# EAGLE design boardPCBlayout2 (EAGLE 9.4.2)
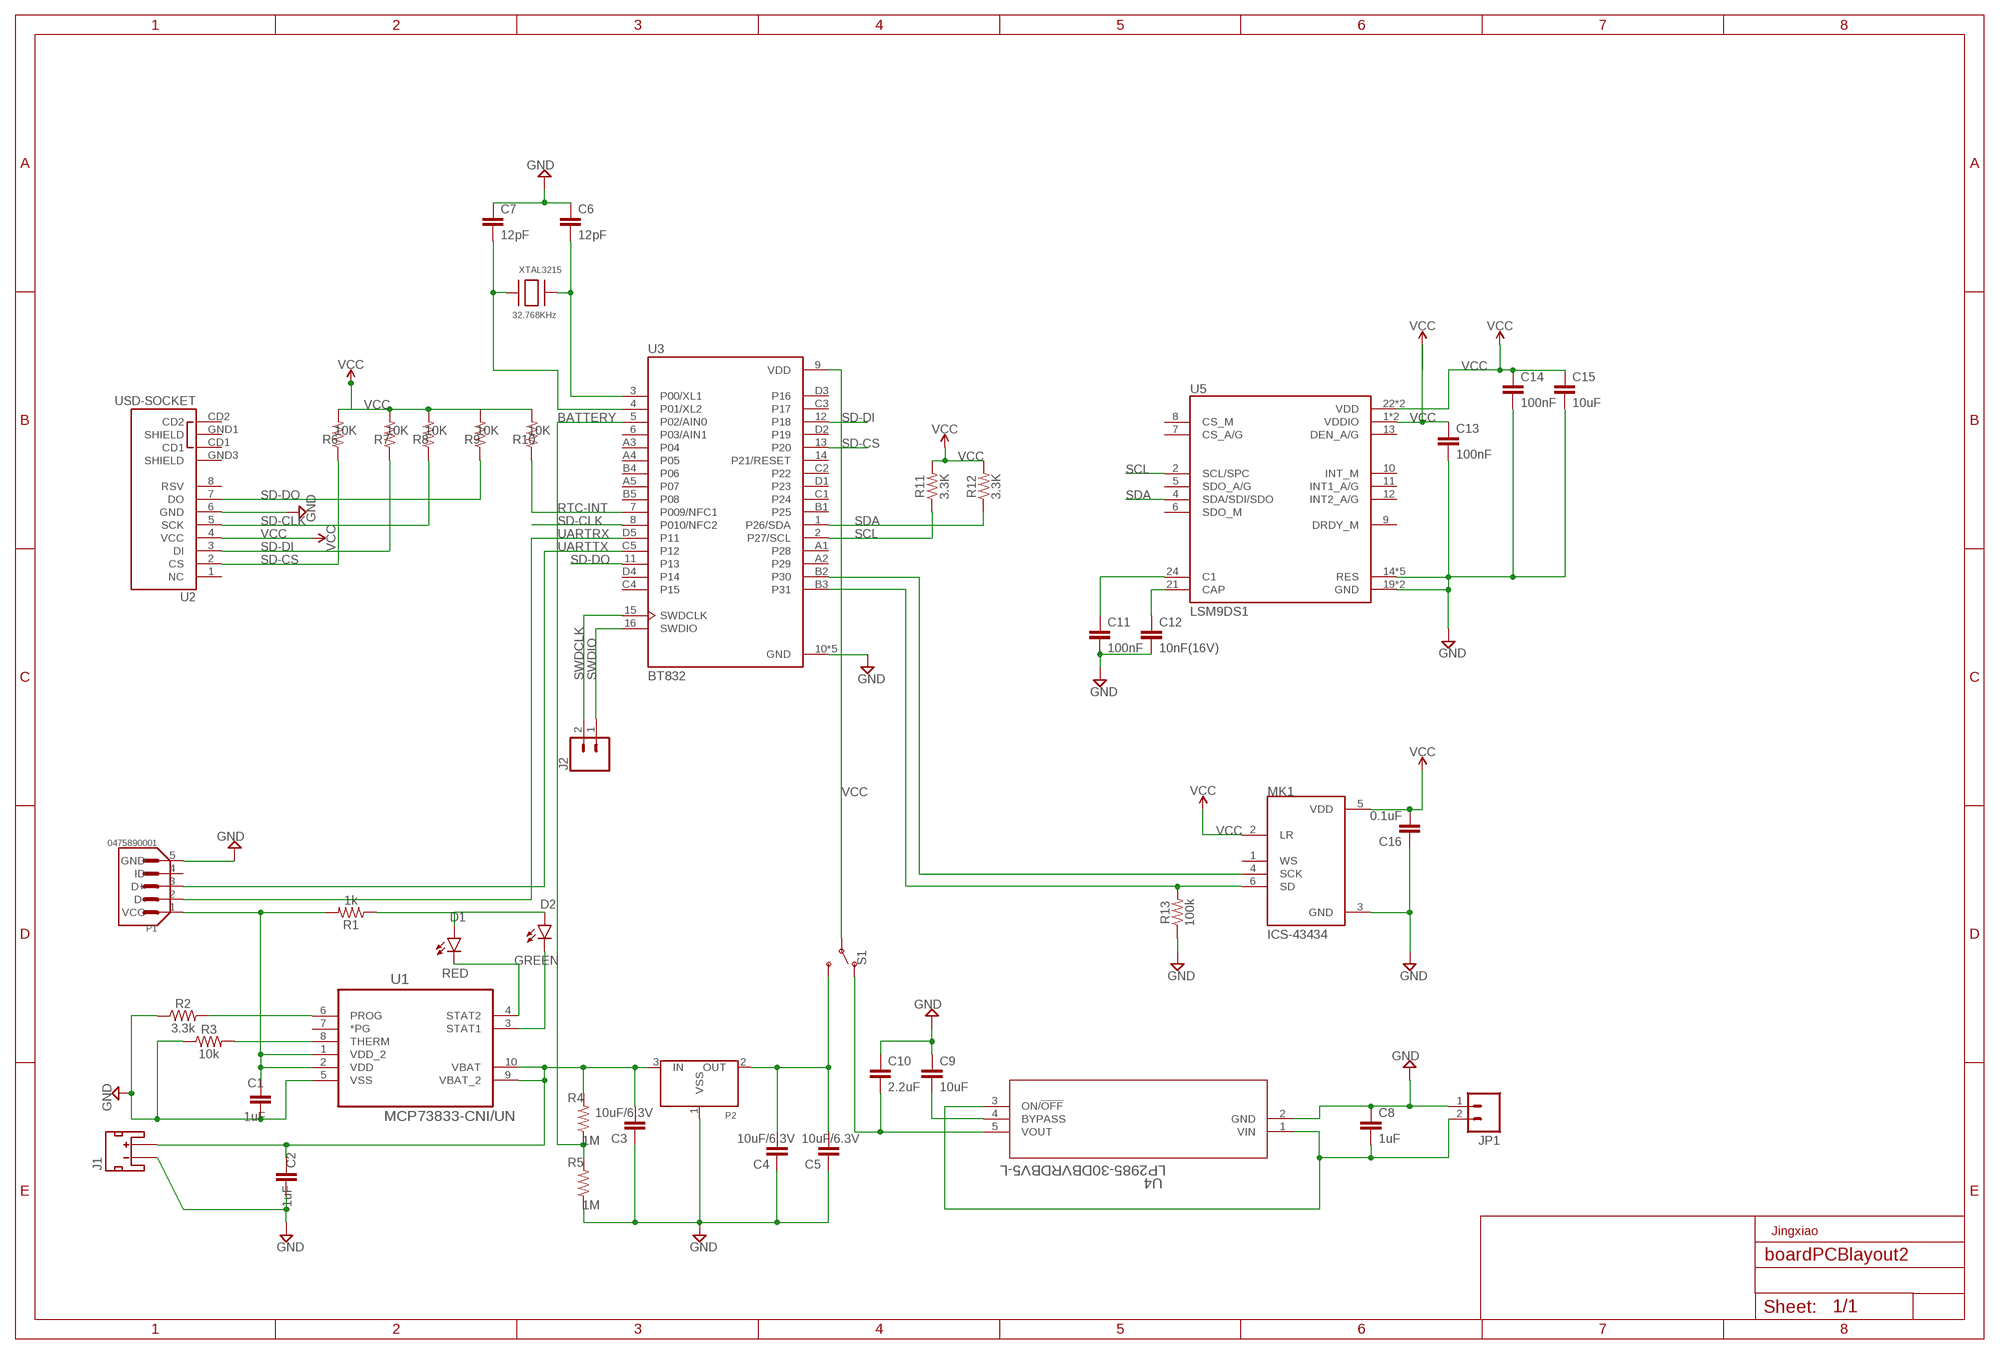
[diagram p0: schematic, sheet 1]

## Parts
C1  1uF  CC0603CRNPO9BN1R0  [CAP_0603]
C2  1uF  CC0603CRNPO9BN1R0  [CAP_0603]
C3  10uF/6.3V  0.18UF-0603-10V-10%  [0603]
C4  10uF/6.3V  0.18UF-0603-10V-10%  [0603]
C5  10uF/6.3V  0.18UF-0603-10V-10%  [0603]
C6  12pF  0.18UF-0603-10V-10%  [0603]
C7  12pF  0.18UF-0603-10V-10%  [0603]
C8  1uF  0.18UF-0603-10V-10%  [0603]
C9  10uF  0.18UF-0603-10V-10%  [0603]
C10  2.2uF  0.18UF-0603-10V-10%  [0603]
C11  100nF  0.18UF-0603-10V-10%  [0603]
C12  10nF(16V)  0.18UF-0603-10V-10%  [0603]
C13  100nF  0.18UF-0603-10V-10%  [0603]
C14  100nF  0.18UF-0603-10V-10%  [0603]
C15  10uF  0.18UF-0603-10V-10%  [0603]
C16  0.1uF  0.18UF-0603-10V-10%  [0603]
D1  RED  LTST-C190TBKT  [LED-0603]
D2  GREEN  LTST-C190TBKT  [LED-0603]
J1  JST_2MM_MALE  [JST-2-SMD]
J2  CONN_02  [1X02]
JP1  M023.5MM-NO_SILK  [SCREWTERMINAL-3.5MM-2-NS]
MK1  ICS-43434  [MIC_ICS-43434]
P1  0475890001  [MOLEX_0475890001]
P2  XC6206SOT-23  [XC6206_SOT-23]
R1  1k  1.6KOHM-0603-1/10W-1%  [0603]
R2  3.3k  14KOHM-0603-1/10W-1%  [0603]
R3  10k  14KOHM-0603-1/10W-1%  [0603]
R4  1M  0.05OHM-0603-1/5W-1%  [0603]
R5  1M  0.05OHM-0603-1/5W-1%  [0603]
R6  10K  0.05OHM-0603-1/5W-1%  [0603]
R7  10K  0.05OHM-0603-1/5W-1%  [0603]
R8  10K  0.05OHM-0603-1/5W-1%  [0603]
R9  10K  0.05OHM-0603-1/5W-1%  [0603]
R10  10K  0.05OHM-0603-1/5W-1%  [0603]
R11  3.3K  0.05OHM-0603-1/5W-1%  [0603]
R12  3.3K  0.05OHM-0603-1/5W-1%  [0603]
R13  100k  0.05OHM-0603-1/5W-1%  [0603]
S1  SWITCH-SPDT-PTH-11.6X4.0MM  [SWITCH_SPDT_PTH_11.6X4.0MM]
U1  MCP73833-CNI/UN  [SOP50P490X110-10N]
U2  USD-SOCKET  [MICROSD_1:1]
U3  BT832  [BLEMODULE_BT832]
U4  LP2985-30DBVRDBV5-L  [DBV5-L]
U5  LSM9DS1  [PQFN24P43_350X300X102L35X23N]
XTAL3215  32.768KHz  XTAL-3.2X1.5  [XTAL3215]

## Nets
BATTERY: R4.1 R5.2 U3.5(P02/AIN0)
GND: C1.2 C3.1 C4.1 C5.1 C6.1 C7.1 C8.1 C9.1 C10.1 C11.2 C12.2 C13.2 C14.2 C15.2 C16.1 JP1.1 MK1.3(GND) P1.5(GND) P2.1(VSS) R2.1 R3.1 R5.1 R13.1 U1.5(VSS) U2.6(GND) U3.10(GND) U3.A0(GND) U3.B0(GND) U3.C0(GND) U3.D0(GND) U4.2(GND) U5.14(RES) U5.15(RES) U5.16(RES) U5.17(RES) U5.18(RES) U5.19(GND) U5.20(GND)
N$1: C1.1 P1.1(VCC) R1.2 U1.1(VDD_2) U1.2(VDD)
N$2: D1.C U1.4(STAT2)
N$3: D1.A D2.A R1.1
N$4: D2.C U1.3(STAT1)
N$5: C2.2 J1.1(-) ; supply symbol labelled GND
N$6: C2.1 C3.2 J1.2(+) P2.3(IN) R4.2 U1.9(VBAT_2) U1.10(VBAT)
N$8: R2.2 U1.6(PROG)
N$9: R3.2 U1.8(THERM)
N$10: MK1.6(SD) R13.2 U3.B3(P31)
N$11: C7.2 U3.4(P01/XL2) XTAL3215.P$1
N$12: C6.2 U3.3(P00/XL1) XTAL3215.P$2
N$13: C10.2 S1.1(O) U4.5(VOUT)
N$14: C12.1 U5.21(CAP)
N$15: C8.2 JP1.2 U4.1(VIN) U4.3(ON/!OFF)
N$16: C9.2 U4.4(BYPASS)
N$18: C11.1 U5.24(C1)
N$19: C4.2 C5.2 P2.2(OUT) S1.3(S)
N$20: MK1.4(SCK) U3.B2(P30)
RTC-INT: R10.1 U3.7(P009/NFC1)
SCL: R11.1 U3.2(P27/SCL) U5.2(SCL/SPC)
SD-CLK: R8.1 U2.5(SCK) U3.8(P010/NFC2)
SD-CS: R6.1 U2.2(CS) U3.13(P20)
SD-DI: R7.1 U2.3(DI) U3.12(P18)
SD-DO: R9.1 U2.7(DO) U3.11(P13)
SDA: R12.1 U3.1(P26/SDA) U5.4(SDA/SDI/SDO)
SWDCLK: J2.2 U3.15(SWDCLK)
SWDIO: J2.1 U3.16(SWDIO)
UARTRX: P1.2(D-) U3.D5(P11)
UARTTX: P1.3(D+) U3.C5(P12)
VCC: C13.1 C14.1 C15.1 C16.2 MK1.2(LR) MK1.5(VDD) R6.2 R7.2 R8.2 R9.2 R10.2 R11.2 R12.2 S1.2(P) U2.4(VCC) U3.9(VDD) U5.1(VDDIO) U5.3(VDDIO) U5.22(VDD) U5.23(VDD)
Unconnected: J1.NC1(PAD1) J1.NC2(PAD2) MK1.1(WS) P1.4(ID) U1.7(*PG) U2.1(NC) U2.8(RSV) U2.CD1 U2.CD2 U2.GND1(SHIELD) U2.GND3(SHIELD) U3.6(P03/AIN1) U3.14(P21/RESET) U3.A1(P28) U3.A2(P29) U3.A3(P04) U3.A4(P05) U3.A5(P07) U3.B1(P25) U3.B4(P06) U3.B5(P08) U3.C1(P24) U3.C2(P22) U3.C3(P17) U3.C4(P15) U3.D1(P23) U3.D2(P19) U3.D3(P16) U3.D4(P14) U5.5(SDO_A/G) U5.6(SDO_M) U5.7(CS_A/G) U5.8(CS_M) U5.9(DRDY_M) U5.10(INT_M) U5.11(INT1_A/G) U5.12(INT2_A/G) U5.13(DEN_A/G)

## Notes on the sheet
- Jingxiao

## Library data of the parts
C1 C2 = Resistor_Capacitor:CC0603CRNPO9BN1R0: CAP CER 1PF 50V C0G/NPO 0603 Manufacturer's datasheet <http://www.yageo.com/documents/recent/UPY-GP_NP0_16V-to-50V_16.pdf>; CREATED_BY: PCBLayout.com; DIGIKEY_PART_NUMBER: 311-1049-2-ND; MANUFACTURER: Yageo; MPN: CC0603CRNPO9BN1R0; PACKAGE: SMD 0603
C3-C16 = SparkFun-Capacitors:0.18UF: 0.18µF ceramic capacitor A capacitor is a passive two-terminal electrical component used to store electrical energy temporarily in an electric field.; PROD_ID: CAP-12380; VALUE: 0.18uF
D1 D2 = LED:LTST-C190TBKT: LED BLUE CLEAR CHIP SMD Manufacturer's datasheet <http://optoelectronics.liteon.com/upload/download/DS-22-99-0224/LTST-C190TBKT.PDF>; CREATED_BY: PCBLayout.com; DIGIKEY_PART_NUMBER: 160-1646-1-ND; MANUFACTURER: Lite-On Inc.; MPN: LTST-C190TBKT; PACKAGE: 0603
J1 = SparkFun-Connectors:JST_2MM_MALE: JST 2MM MALE RA CONNECTOR Two pin, compact surface mount connector. Commonly used as a battery input connection point. We really like the solid locking feeling and high current rating on these small connectors. We use these all the time as battery connectors. Mates to single-cell LiPo batteries. Here is the connector we sell at SparkFun: JST Right Angle Connector - White <https://www.sparkfun.com/products/8612> (PRT-08612) Datasheet <http://www.sparkfun.com/datasheets/Prototyping/Connectors/JST-Horizontal.pdf> It was used on these SparkFun products: SparkFun MOSFET Power Controller <https://www.sparkfun.com/products/11214> (PRT-11214) SparkFun Battery Babysitter - LiPo Battery Manager <https://www.sparkfun.com/products/13777> (PRT-13777) And many, many others that required a lipo battery connection.; PROD_ID: CONN-11443; SF_ID: PRT-08612
J2 = SparkFun-Connectors:CONN_02: Multi connection point. Often used as Generic Header-pin footprint for 0.1 inch spaced/style header connections On any of the 0.1 inch spaced packages, you can populate with these: Break Away Headers - Straight <https://www.sparkfun.com/products/116> (PRT-00116) Break Away Male Headers - Right Angle <https://www.sparkfun.com/products/553> (PRT-00553) Female Headers <https://www.sparkfun.com/products/115> (PRT-00115) Break Away Headers - Machine Pin <https://www.sparkfun.com/products/117> (PRT-00117) Break Away Female Headers - Swiss Machine Pin <https://www.sparkfun.com/products/743> (PRT-00743) For SCREWTERMINALS and SPRING TERMINALS visit here: Screw Terimnals on SparkFun.com <https://www.sparkfun.com/search/results?term=Screw+Terminals> (5mm/3.5mm/2.54mm spacing) This device is also useful as a general connection point to wire up your design to another part of your project. Our various solder wires solder well into these plated through hole pads. Hook-Up Wire - Assortment (Stranded, 22 AWG) <https://www.sparkfun.com/products/11375> (PRT-11375) Hook-Up Wire - Assortment (Solid Core, 22 AWG) <https://www.sparkfun.com/products/11367> (PRT-11367) View the entire wire category on our website here <https://www.sparkfun.com/categories/141> Special notes: Molex polarized connector foot print use with: PRT-08233 with associated crimp pins and housings. 2.54_SCREWTERM for use with PRT-10571. 3.5mm Screw Terminal footprints for PRT-08084 5mm Screw Terminal footprints for use with PRT-08432
JP1 = screw hold connector:M02: Standard 2-pin 0.1" header. Use with - straight break away headers ( PRT-00116) - right angle break away headers (PRT-00553) - swiss pins (PRT-00743) - machine pins (PRT-00117) - female headers (PRT-00115) Molex polarized connector foot print use with: PRT-08233 with associated crimp pins and housings. 2.54_SCREWTERM for use with PRT-10571. 3.5mm Screw Terminal footprints for PRT-08084 5mm Screw Terminal footprints for use with PRT-08432; PROD_ID: CONN-08399
MK1 = ICS-43434:ICS-43434: Multi-Mode Microphone with I2S Digital Output; AVAILABILITY: Unavailable; DESCRIPTION: Multi-Mode Microphone with I2S Digital Output; MF: TDK InvenSense; MP: ICS-43434; PACKAGE: LGA-6 TDK-InvenSense; PRICE: None
P1 = USB battery charger:0475890001: Conn Micro USB Type AB RCP 5 POS 0.65mm Solder RA SMD 5 Terminal 1 Port T/R; DESCRIPTION: Conn Micro USB Type AB RCP 5 POS 0.65mm Solder RA SMD 5 Terminal 1 Port T/R; DIGI-KEY_PART_NUMBER: WM17143CT-ND; DIGI-KEY_PURCHASE_URL: https://www.digikey.com/product-detail/en/molex/0475890001/WM17143CT-ND/1832255?utm_source=snapeda&utm_medium=aggregator&utm_campaign=symbol; MF: Molex; MP: 0475890001; PACKAGE: None
P2 = Voltage Regulator:XC6206: XC6206P , linear regulator. Producted by TOREX.Co Store Information: EXCEL device corporation http://www.excel-d.com/access/index.html
R1 = SparkFun-Resistors:1.6KOHM: 1.6kΩ resistor A resistor is a passive two-terminal electrical component that implements electrical resistance as a circuit element. Resistors act to reduce current flow, and, at the same time, act to lower voltage levels within circuits. - Wikipedia; PROD_ID: RES-08361; VALUE: 1.6k
R2 R3 = SparkFun-Resistors:14KOHM: 14kΩ resistor A resistor is a passive two-terminal electrical component that implements electrical resistance as a circuit element. Resistors act to reduce current flow, and, at the same time, act to lower voltage levels within circuits. - Wikipedia; PROD_ID: RES-13340; VALUE: 14k
R4-R13 = SparkFun-Resistors:0.05OHM: 0.05Ω resistor A resistor is a passive two-terminal electrical component that implements electrical resistance as a circuit element. Resistors act to reduce current flow, and, at the same time, act to lower voltage levels within circuits. - Wikipedia; PROD_ID: RES-12535; VALUE: 0.05
S1 = 2positon jumper:SWITCH-SPDT: Single Pole, Double Throw (SPDT) Switch Single-pole, double-throw (SPDT) switch. Variant Overview SMD-AYZ0202 Surface Mount DPDT Switch <https://www.sparkfun.com/products/597> (COM-00597) Used on e.g. LilyPad Arduino USB - ATmega32U4 Board <https://www.sparkfun.com/products/12049> PTH-11.6X4.0MM SPDT Mini Power Switch <https://www.sparkfun.com/products/102> (COM-00102) Used on e.g. SparkFun Simon Says - Through-Hole Soldering Kit <https://www.sparkfun.com/products/10547> (KIT-10547) PTH-11.6X4.0MM-KIT KIT version of SPDT Mini Power Switch - Simplifies soldering by removing tStop of switch pins - only one side can be soldered. PTH-11.6X4.0MM-LOCK LOCK version of SPDT Mini Power Switch - Offset pins hold switch in place for easier soldering. SMD-RIGHT-ANGLE Surface Mount Right Angle Switch <https://www.sparkfun.com/products/10860> (COM-10860) Used on e.g. SparkFun ESP8266 Thing <https://www.sparkfun.com/products/13231>; PROD_ID: SWCH-08261; SF_SKU: COM-00102
U1 = MCP73833-CNI_UN:MCP73833-CNI/UN: LI-ION/LI-POLY CONTROLLERS; DESCRIPTION: Linear Charge Management Controller Li-Ion/Li-Pol 1mA 4.2V/4.35V/4.4V/4.5V 10-Pin MSOP Tube; DIGI-KEY_PART_NUMBER: MCP73833-CNI/UN-ND; DIGI-KEY_PURCHASE_URL: https://www.digikey.com/product-detail/en/microchip-technology/MCP73833-CNI-UN/MCP73833-CNI-UN-ND/1223169?utm_source=snapeda&utm_medium=aggregator&utm_campaign=symbol; MF: Microchip; MP: MCP73833-CNI/UN; PACKAGE: MSOP-10 Microchip
U2 = micro SD card holder:USD-SOCKET: microSD Socket Push-push type uSD socket. Schematic element and footprint production proven. Spark Fun Electronics SKU : PRT-00127. tDoc lines correctly indicate media card edge positions when inserting (unlocked, locked, depressed). NOTE: CD1 and CD2 are connected internally; PROD_ID: CONN-07820
U3 = BT832:BT832: BLE 5 Module: Nordic nRF52832 SoC, Cortex M4F with PCB trace antenna; AVAILABILITY: Unavailable; DESCRIPTION: BLE 5 Module: Nordic nRF52832 SoC, Cortex M4F with PCB trace antenna; MF: Fanstel Corp.; MP: BT832; PACKAGE: SMD-16 Fanstel; PRICE: None
U4 = LP2985:LP2985-30DBVR; MANUFACTURER_PART_NUMBER: LP298530DBVR; VENDOR: Texas Instruments
U5 = LSM9DS1:LSM9DS1: iNEMO inertial module: 3D accelerometer, 3D gyroscope, 3D magnetometer; AVAILABILITY: Unavailable; DESCRIPTION: iNEMO inertial module: 3D accelerometer, 3D gyroscope, 3D magnetometer; MF: STMicroelectronics; MP: LSM9DS1; PACKAGE: TFLGA-24 STMicroelectronics; PRICE: None
XTAL3215 = XTAL3215:XTAL: Low cost SMT crystals, no capacitors included http://www.ladyada.net/library/eagle

## Board
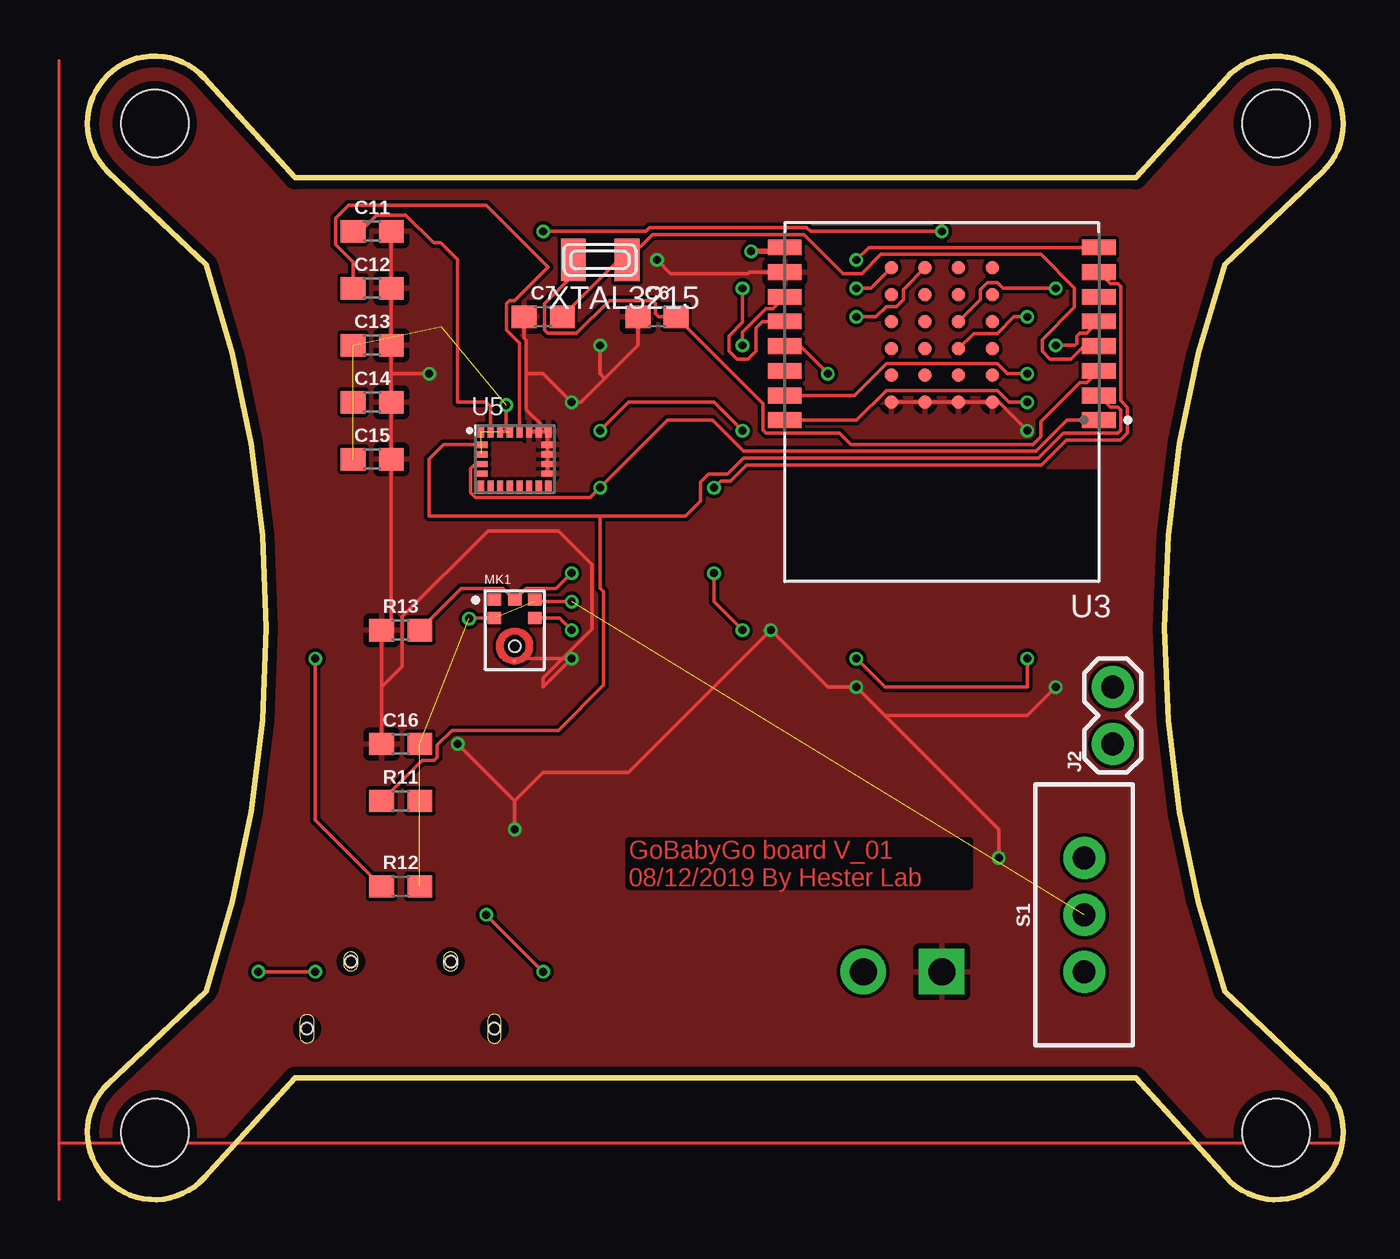
[diagram p1: board, top side]
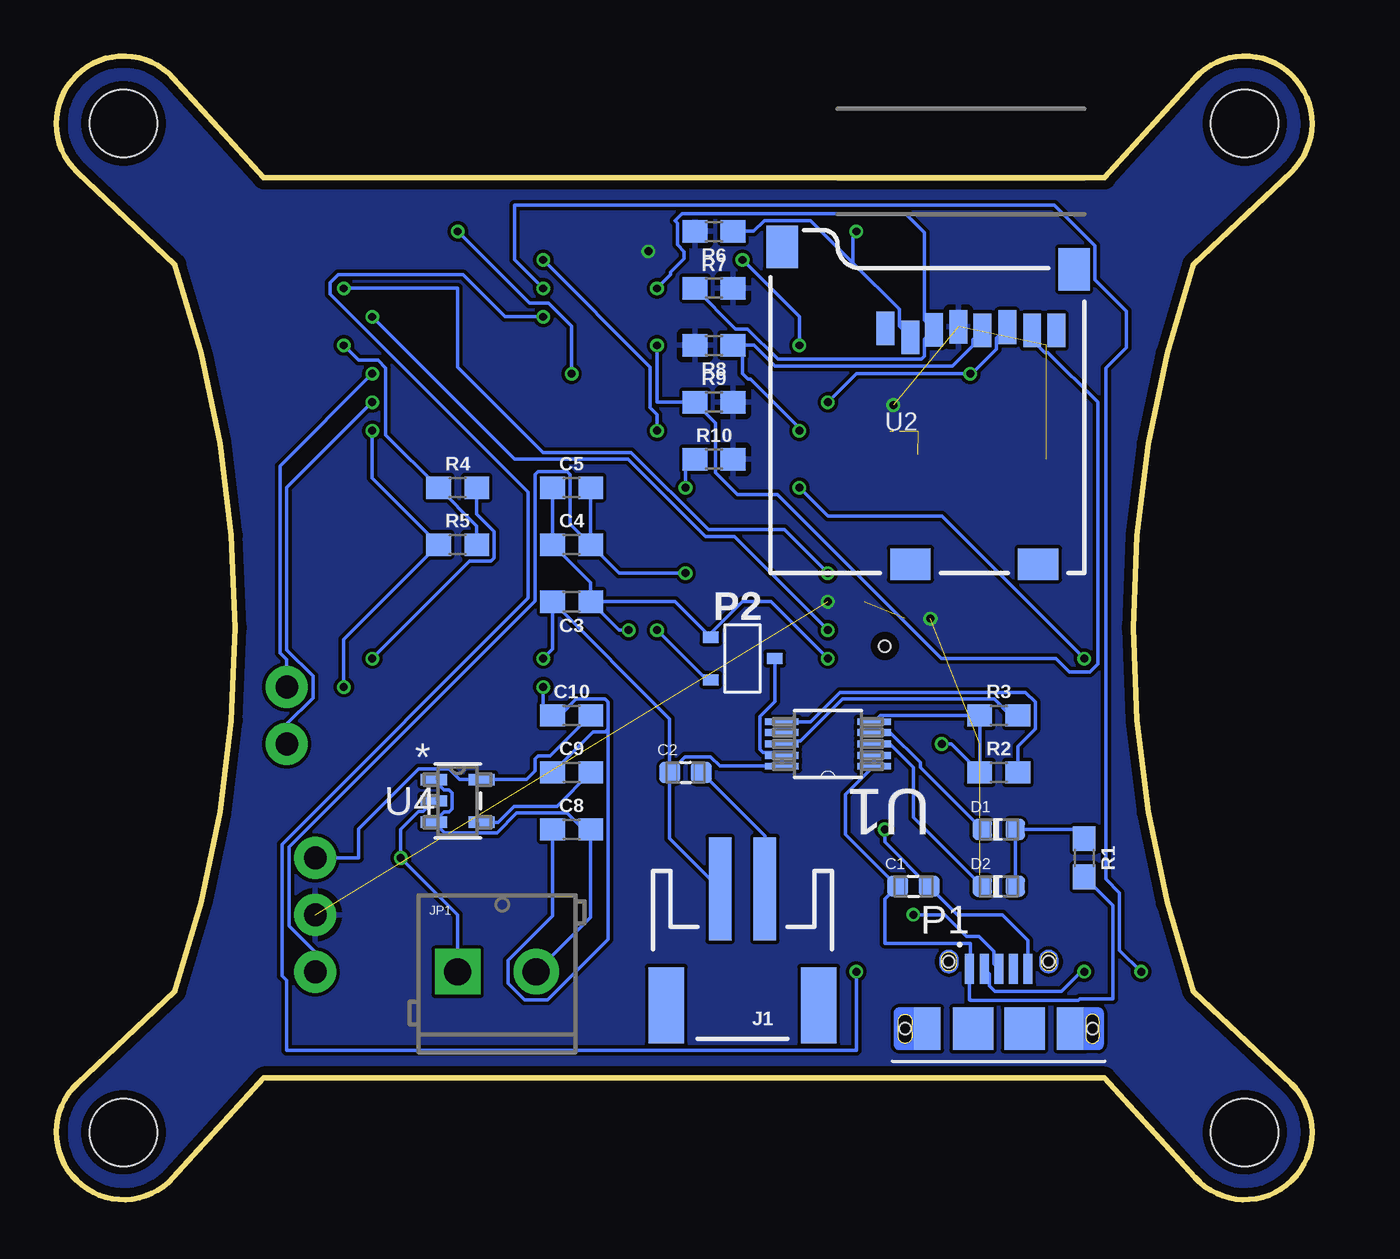
[diagram p2: board, bottom side, seen from below]

Size 56 x 51 mm. Coordinates in mm from the lower left corner, seen from the top.
Outline: 55.07,45.83 arc184 50.78,50.01 46.75,45.57 9.25,45.57 5.22,50.01 arc184 0.93,45.83 5.29,41.7 arc-38 5.29,9.29 0.93,5.17 arc184 5.22,0.98 9.25,5.43 46.75,5.43 50.78,0.98 arc184 55.07,5.17 50.71,9.29 arc-38 50.71,41.7 55.07,45.83
Copper layers (1*16): Top 0.035559375mm / dielectric 1.6mm / Bottom 0.035559375mm
Design rules "oshpark-2layer": minimum track width 6mil, minimum drill 10mil, track to track 6mil, track to pad 6mil, pad to pad 6mil, via to via 6mil, smd to smd 6mil, copper to edge 15mil, drill to drill 6mil, minimum pad ring 5mil, minimum via ring 5mil, stop-mask expansion 2.5mil, vias tented up to drill 0mil, thermal gap 10mil
Holes 3 mm at 53,48 53,3 3,48 3,3

### Footprints (pad centres in the part's own frame; a part is rotated, then mirrored left to right if it is on the bottom)
CAP_0603 = smd 0.92 x 0.93: 1 -0.705,0; 2 0.705,0
0603 = smd 1.1 x 1: 1 -0.85,0; 2 0.85,0
LED-0603 = smd 0.86 x 0.93: A 0.735,0; C -0.735,0
JST-2-SMD = smd 1 x 4.6: 1 -1,-3.7; 2 1,-3.7 | smd 1.6 x 3.4: NC1 -3.4,1.5; NC2 3.4,1.5
1X02 = drill 1.016 pad 1.88: 1 0,0; 2 2.54,0
SCREWTERMINAL-3.5MM-2-NS = drill 1.2 pad 2.032 square: 1 0,0 | drill 1.2 pad 2.032: 2 3.5,0
MIC_ICS-43434 = smd 0.6 x 0.522: 1 -0.9,1.361; 2 -0.9,0.539; 4 0.9,0.539; 5 0.9,1.361; 6 0,1.361 | smd 0.1 x 0.1: 3 -0.015,-1.383 | hole 0.5: 0,-0.713
MOLEX_0475890001 = smd 0.4 x 1.35: 1 -1.3,2.675; 2 -0.65,2.675; 3 0,2.675; 4 0.65,2.675; 5 1.3,2.675 | smd 1.175 x 1.9: 6 -3.187,0; 9 3.187,0 | smd 1.8 x 1.9: 7 -1.15,0; 8 1.15,0 | hole 0.5: -2.225,3; 2.225,3; -4.175,0; 4.175,0
XC6206_SOT-23 = smd 0.5 x 0.7: 1 -0.95,-1.415; 2 0.95,-1.415; 3 0,1.44
SWITCH_SPDT_PTH_11.6X4.0MM = drill 1.016 pad 1.88: 1 0,2.54; 2 0,0; 3 0,-2.54
SOP50P490X110-10N = smd 1.499 x 0.305: 1 -2.057,0.991; 2 -2.057,0.508; 3 -2.057,0; 4 -2.057,-0.508; 5 -2.057,-0.991; 6 2.057,-0.991; 7 2.057,-0.508; 8 2.057,0; 9 2.057,0.508; 10 2.057,0.991
MICROSD_1:1 = smd 0.8 x 1.5: 1 5.096,10.919; 2 6.218,10.519; 3 7.274,10.853; 4 8.367,10.982; 5 9.421,10.828; 6 10.539,10.973; 7 11.648,10.819; 8 12.721,10.819 | smd 1.8 x 1.4: CD1 11.92,0.4; CD2 6.22,0.4 | smd 1.4 x 1.9: GND1 0.497,14.55; GND3 13.52,13.55
BLEMODULE_BT832 = smd 1.5 x 0.7: 1 -7,0.8; 2 -7,-0.3; 3 -7,-1.4; 4 -7,-2.5; 5 -7,-3.6; 6 -7,-4.7; 7 -7,-5.8; 8 -7,-6.9; 9 7,-6.9; 10 7,-5.8; 11 7,-4.7; 12 7,-3.6; 13 7,-2.5; 14 7,-1.4; 15 7,-0.3; 16 7,0.8 | smd 0.6 x 0.6: A0 -2.25,0; A1 -2.25,-1.2; A2 -2.25,-2.4; A3 -2.25,-3.6; A4 -2.25,-4.8; A5 -2.25,-6; B0 -0.75,0; B1 -0.75,-1.2; B2 -0.75,-2.4; B3 -0.75,-3.6; B4 -0.75,-4.8; B5 -0.75,-6; C0 0.75,0; C1 0.75,-1.2; C2 0.75,-2.4; C3 0.75,-3.6; C4 0.75,-4.8; C5 0.75,-6; D0 2.25,0; D1 2.25,-1.2; D2 2.25,-2.4; D3 2.25,-3.6; D4 2.25,-4.8; D5 2.25,-6
DBV5-L = smd 1.168 x 0.508: 1 -1.067,0.95; 2 -1.067,0; 3 -1.067,-0.95; 4 1.067,-0.95; 5 1.067,0.95
PQFN24P43_350X300X102L35X23N = smd 0.28 x 0.53: 1 -1.505,1.225; 6 -1.505,-1.225; 7 -1.075,-1.225; 8 -0.645,-1.225; 9 -0.215,-1.225; 10 0.215,-1.225; 11 0.645,-1.225; 12 1.075,-1.225; 13 1.505,-1.225; 18 1.505,1.225; 19 1.075,1.225; 20 0.645,1.225; 21 0.215,1.225; 22 -0.215,1.225; 23 -0.645,1.225; 24 -1.075,1.225 | smd 0.53 x 0.28: 2 -1.47,0.645; 3 -1.47,0.215; 4 -1.47,-0.215; 5 -1.47,-0.645; 14 1.47,-0.645; 15 1.47,-0.215; 16 1.47,0.215; 17 1.47,0.645
XTAL3215 = smd 1.1 x 1.9: P$1 1.2,0; P$2 -1.2,0

### Placement (x,y rotation side)
C1  17.78,13.97 0 bottom
C2  27.94,19.05 0 bottom
C3  33.02,26.67 180 bottom
C4  33.02,29.21 0 bottom
C5  33.02,31.75 0 bottom
C6  25.4,39.37 0 top
C7  20.32,39.37 0 top
C8  33.02,16.51 0 bottom
C9  33.02,19.05 0 bottom
C10  33.02,21.59 0 bottom
C11  12.7,43.18 0 top
C12  12.7,40.64 0 top
C13  12.7,38.1 0 top
C14  12.7,35.56 0 top
C15  12.7,33.02 0 top
C16  13.97,20.32 0 top
D1  13.97,16.51 0 bottom
D2  13.97,13.97 0 bottom
J1  25.4,10.16 180 bottom
J2  45.72,20.32 90 top
JP1  38.1,10.16 0 bottom
MK1  19.05,25.4 0 top
P1  13.97,7.62 0 bottom
P2  25.4,24.13 270 bottom
R1  10.16,15.24 270 bottom
R2  13.97,19.05 0 bottom
R3  13.97,21.59 0 bottom
R4  38.1,31.75 0 bottom
R5  38.1,29.21 0 bottom
R6  26.67,43.18 180 bottom
R7  26.67,40.64 0 bottom
R8  26.67,38.1 180 bottom
R9  26.67,35.56 0 bottom
R10  26.67,33.02 0 bottom
R11  13.97,17.78 0 top
R12  13.97,13.97 0 top
R13  13.97,25.4 0 top
S1  44.45,12.7 0 top
U1  21.59,20.32 180 bottom
U2  24.13,27.94 0 bottom
U3  38.1,35.56 180 top
U4  38.1,17.78 0 bottom
U5  19.05,33.02 0 top
XTAL3215  22.86,41.91 0 top

### Tracks (layer width: path | path; a pad name or v marks a point on that pad's centre or on a via)
BATTERY  (via drill 0.35)
  Top 0.152: v43.18,38.1 44.04,38.1 44.12,38.18 44.12,38.5 44.25,38.64 44.58,38.64 U3.5
  Bottom 0.152: R5.2 37.25,30.05 R4.1 41.3,34.1 41.3,37.08 41.66,37.44 42.52,37.44 v43.18,38.1
GND  (via drill 0.35)
  Top 0.152: v34.29,22.86 33.02,22.86 v30.48,25.4 24.13,19.05 20.32,19.05 19.05,17.78 | v34.29,22.86 35.56,21.59 41.91,21.59 v43.18,22.86 | v34.29,22.86 40.64,16.51 v40.64,15.24 | v16.51,20.32 19.05,17.78 | v19.05,16.51 19.05,17.78 | C16.1 13.12,22.86 | 13.12,22.86 R13.1 13.55,25.83 C15.2 C14.2 13.55,36.83 | C11.2 C12.2 C13.2 13.55,36.83 | C7.1 19.47,38.43 19.57,38.33 19.57,36.83 | U5.18 19.57,35.23 19.57,36.83 | U5.20 U5.19 U5.18 | U5.18 20.52,34.21 U5.17 U5.16 U5.15 U5.14 | U3.D0 U3.C0 U3.B0 U3.A0 40.64,35.56 v41.91,34.29 | 19.57,36.83 20.32,36.83 v21.59,35.56 22.01,35.56 23.07,36.62 | 23.07,36.62 24.55,38.1 C6.1 | MK1.3 19.15,24.13 v21.59,24.13 20.32,22.86 20.32,23.27 22.5,25.45 22.5,28.32 21,29.82 17.86,29.82 14.04,25.99 14.04,23.78 13.12,22.86 | U3.10 29.52,41.36 29.46,41.3 26.01,41.3 v25.4,41.91 | 23.07,36.62 22.86,36.83 v22.86,38.1 | 13.55,36.83 v15.24,36.83
  Bottom 0.152: C3.1 28.4,26.67 P2.1 26.81,25.25 25.4,26.67 24.13,26.67 v21.59,24.13 | C5.1 C4.1 32.17,27.51 C3.1 | U1.5 19.25,21.59 R3.1 R2.1 16.09,20.32 v16.51,20.32 | 31.39,20.99 31.39,22.18 31.52,22.32 32.81,22.32 33.54,21.59 C10.1 34.29,22.01 v34.29,22.86 | 31.39,20.99 31.52,20.86 32.06,20.86 C9.1 | P1.5 12.67,11.56 13.8,12.7 15.8,12.7 C1.2 19.05,15.94 v19.05,16.51 | v43.18,22.86 43.18,24.99 40.89,27.28 40.88,27.28 R5.1 41.91,32.17 v41.91,34.29 | C3.1 30.9,25.4 v30.48,25.4 | U4.2 39.63,17.31 39.85,17.31 40.64,16.52 v40.64,15.24 38.1,12.7 JP1.1 | U2.6 14.08,38.42 14.08,37.92 15.17,36.83 v15.24,36.83 20.32,36.83 v21.59,35.56 | v22.86,38.1 22.86,39.37 v25.4,41.91 | C8.1 33.87,12.65 35.84,10.67 35.84,9.64 35.12,8.91 34.08,8.91 31.39,11.61 31.39,20.99
  pour Top: -3.81,52.07 57.15,52.07 57.15,-1.27 -3.81,-1.27
N$1
  Bottom 0.152: R1.2 8.89,13.12 8.89,8.96 10.35,8.96 10.42,8.89 15.24,8.89 15.27,8.92 P1.1 15.24,10.32 15.24,11.43 19.05,11.43 19.05,13.4 C1.1 20.8,16.29 20.8,18.06 U1.1 U1.2
N$2
  Bottom 0.152: D1.C 17.47,19.28 17.47,19.49 18.82,20.83 U1.4
N$3
  Bottom 0.152: R1.1 10.58,16.51 D1.A D2.A
N$4
  Bottom 0.152: D2.C 17.78,17.04 17.78,19.28 18.82,20.32 U1.3
N$5
  Bottom 0.152: J1.1 24.4,16.21 C2.2
N$6  (via drill 0.35)
  Top 0.152: v41.91,24.13 41.91,22.86 35.56,22.86 v34.29,24.13
  Bottom 0.152: J1.2 28.64,16.1 C2.1 | C2.1 27.95,19.74 26.81,19.74 26.4,19.33 U1.10 U1.9 23.77,19.94 24.49,19.94 24.62,20.07 24.62,21.56 23.96,22.22 P2.3 | C2.1 28.64,21.44 C3.2 33.87,24.55 v34.29,24.13 | R4.2 37.25,30.58 36.47,29.8 36.47,28.61 36.6,28.48 37.56,28.48 v41.91,24.13
N$8
  Bottom 0.152: U1.6 22.37,21.31 21.06,22.62 12.78,22.62 12.34,22.18 12.34,20.99 13.12,20.22 R2.2
N$9
  Bottom 0.152: U1.8 23.52,20.45 22.8,20.45 20.93,22.32 14.17,22.32 13.45,21.59 R3.2
N$10  (via drill 0.35)
  Top 0.152: R13.2 16.67,27.25 18.54,27.25 19.03,26.76 MK1.6 19.07,26.76 19.55,27.25 20.9,27.25 v21.59,27.94 | v43.18,40.64 40.82,40.64 40.57,40.89 40.13,40.89 39.82,40.58 39.82,40.13 U3.B3
  Bottom 0.152: v21.59,27.94 23.52,29.87 26.92,29.87 30.37,33.32 34.29,33.32 38.1,37.13 38.1,40.64 v43.18,40.64
N$11
  Top 0.152: C7.2 23.71,41.91 XTAL3215.P$1 25.19,43.04 31.94,43.04 33.68,41.3 34.54,41.3 35.39,42.15 42.52,42.15 44.02,40.66 44.02,39.8 42.57,38.35 42.57,37.85 42.93,37.49 43.86,37.49 44.43,38.06 U3.4
N$12
  Top 0.152: XTAL3215.P$2 21.66,41.23 20.39,39.96 20.39,38.77 20.52,38.64 21.81,38.64 23.27,40.1 25.19,40.1 25.33,39.96 25.33,39.51 25.47,39.37 C6.2 30.12,35.5 30.12,34.31 30.25,34.18 33.54,34.18 34.04,33.68 42.16,33.68 42.52,34.04 42.52,34.7 44.25,36.44 44.58,36.44 U3.3
N$13
  Bottom 0.152: C10.2 33.98,19.78 34.51,19.78 34.65,19.64 34.65,19.11 35.03,18.73 U4.5 38,18.73 38.49,19.21 39.85,19.21 42.52,16.54 42.52,15.24 S1.1
N$14
  Top 0.152: C12.1 11.85,41.81 11.07,42.58 11.07,43.77 11.65,44.35 17.78,44.35 20.53,41.59 19.04,40.1 18.82,40.1 18.69,39.96 18.69,38.77 19.26,38.2 U5.21
N$15
  Bottom 0.152: JP1.2 32.17,12.59 C8.2 32.5,16.51 33.22,17.24 35.46,17.24 36.35,16.35 38.68,16.35 U4.3 38.7,17.3 38.49,17.3 38.35,17.43 38.35,18.13 38.49,18.26 38.7,18.26 U4.1
N$16
  Bottom 0.152: U4.4 36.3,16.83 35.59,17.54 33.68,17.54 C9.2
N$18
  Top 0.152: C11.1 12.18,43.18 12.9,43.91 14.19,43.91 15.43,42.67 15.75,42.67 16.51,41.91 16.51,35.56 17.78,35.56 17.97,35.36 U5.24
N$19  (via drill 0.35)
  Top 0.152: v27.94,27.94 27.94,26.67 v29.21,25.4
  Bottom 0.152: P2.2 26.99,23.18 v29.21,25.4 | C4.2 30.9,27.94 v27.94,27.94 | C5.2 C4.2 | S1.3 44.45,11.05 45.62,12.21 45.62,15.72 34.65,26.69 34.65,32.34 34.51,32.48 33.22,32.48 33.09,32.34 33.09,30.13 C4.2
N$20  (via drill 0.35)
  Top 0.152: MK1.4 21.05,25.94 v21.59,25.4 | U3.B2 39.52,38.63 40.57,38.63 41.31,39.37 v41.91,39.37
  Bottom 0.152: v21.59,25.4 25.76,29.57 27.05,29.57 30.5,33.02 35.56,33.02 v41.91,39.37
RTC-INT  (via drill 0.35)
  Top 0.152: v27.94,31.75 28.24,32.05 28.67,32.05 29.39,32.77 42.54,32.77 43.65,33.88 46.07,33.88 46.38,34.19 46.38,35.33 46.08,35.63 46.08,40.7 45.94,40.84 45.62,40.84 U3.7
  Bottom 0.152: R10.1 27.94,32.6 v27.94,31.75
SCL
  Top 0.152: U5.2 15.88,33.66 15.24,33.02 15.24,30.48 22.86,30.48 | R11.1 14.93,19.59 15.46,19.59 15.6,19.72 15.6,20.27 16.26,20.93 21,20.93 23.02,22.95 23.02,27.12 22.86,27.27 22.86,30.48 | 22.86,30.48 26.67,30.48 27.33,31.14 27.33,32 27.69,32.36 28.55,32.36 29.26,33.07 42.41,33.07 43.52,34.18 45.94,34.18 46.08,34.31 46.08,35.2 45.94,35.34 45.62,35.34 U3.2
SD-CLK  (via drill 0.35)
  Top 0.152: U3.8 34.84,42.46 v34.29,41.91 | v29.21,34.29 27.94,35.56 24.13,35.56 v22.86,34.29
  Bottom 0.152: U2.5 15.13,38.34 15.13,38.08 16.04,37.17 23.95,37.17 24.88,38.1 R8.1 25.4,37.68 25.4,36.83 25.16,36.59 25.05,36.59 22.86,34.4 v22.86,34.29 | v34.29,41.91 29.51,37.13 29.51,35.32 29.21,35.01 v29.21,34.29
SD-CS  (via drill 0.35)
  Top 0.152: U3.13 31.79,38.06 v33.02,36.83 | v38.1,43.18 32.23,43.18 32.07,43.34 25.06,43.34 24.9,43.18 v20.32,43.18
  Bottom 0.152: R6.1 24.92,43.18 24.43,43.67 22.37,43.67 20.47,41.76 | U2.2 18.41,38.95 18.41,39.7 20.47,41.76 | 20.47,41.76 20.47,43.03 v20.32,43.18 | v38.1,43.18 34.9,39.98 34.04,39.98 33.02,38.96 v33.02,36.83
SD-DI  (via drill 0.35)
  Top 0.152: U3.12 30.11,39.16 29.82,38.87 29.82,37.85 29.46,37.49 28.96,37.49 28.6,37.85 28.6,38.52 29.21,39.12 v29.21,40.64
  Bottom 0.152: R7.1 25.71,38.83 25.17,38.83 23.83,37.48 17.42,37.48 17.28,37.61 17.28,38.36 U2.3 17.28,39.22 17.28,43.11 18.14,43.97 28.1,43.97 28.42,43.66 28.3,43.54 28.3,42.58 28,42.28 28,41.97 28.6,41.36 28.6,41.25 v29.21,40.64
SD-DO  (via drill 0.35)
  Top 0.152: U3.11 30.58,39.74 30.25,39.74 29.21,38.69 v29.21,38.1
  Bottom 0.152: v29.21,38.1 29.21,35.56 R9.1 26.6,34.64 26.6,32.42 25.62,31.44 23.84,31.44 16.53,24.13 11.43,24.13 10.82,23.52 9.91,23.52 9.55,23.88 9.55,35.56 11.77,37.78 11.9,37.78 12.48,38.36 U2.7
SDA  (via drill 0.35)
  Top 0.152: U5.4 17.52,32.74 17.22,32.74 17.09,32.61 17.09,31.52 17.31,31.3 22.41,31.3 v22.86,31.75 25.87,34.76 27.88,34.76 29.26,33.38 42.29,33.38 43.67,34.76 U3.1 | R12.1 10.16,16.93 v10.16,24.13
  Bottom 0.152: v10.16,24.13 16.51,30.48 21.59,30.48 v22.86,31.75
SWDCLK  (via drill 0.35)
  Top 0.152: U3.15 34.2,35.86 35.63,37.29 40.57,37.29 41.03,36.83 v41.91,36.83
  Bottom 0.152: J2.2 45.72,24.08 46.02,24.38 46.02,32.71 v41.91,36.83
SWDIO  (via drill 0.35)
  Top 0.152: v41.91,35.56 41.1,35.56 40.57,36.09 35.63,36.09 34.3,34.76 U3.16
  Bottom 0.152: v41.91,35.56 45.72,31.75 45.72,24.51 44.55,23.34 44.55,22.37 45.72,21.21 J2.1
UARTRX  (via drill 0.35)
  Top 0.152: U3.D5 34.93,40.64 v34.29,40.64 | v7.62,10.16 v10.16,10.16
  Bottom 0.152: v34.29,40.64 35.56,41.91 35.56,44.35 11.5,44.35 9.68,42.53 9.68,41.02 8.28,39.62 8.28,37.99 9.2,37.07 9.2,14.29 8.58,13.68 8.58,11.12 v7.62,10.16 | v10.16,10.16 10.31,10.16 11.19,9.28 14.15,9.28 14.4,9.52 14.4,10.07 P1.2
UARTTX  (via drill 0.35)
  Top 0.152: v34.29,39.37 35.16,39.37 35.62,39.83 36.07,39.83 36.38,40.14 36.38,40.59 U3.C5 | v17.78,12.7 v20.32,10.16
  Bottom 0.152: v34.29,39.37 35.99,39.37 37.86,41.25 43.43,41.25 43.79,40.89 43.79,40.64 43.79,40.39 34.95,31.55 34.95,26.82 45.92,15.85 45.92,9.98 45.72,9.78 45.72,6.65 20.32,6.65 v20.32,10.16 | v17.78,12.7 16.37,12.7 15.41,11.73 14.86,11.73 14.19,11.06 14.19,10.51 P1.3
VCC  (via drill 0.35)  (12 unrouted)
  Top 0.152: U5.23 18.67,34.24 v18.67,35.43 | MK1.2 17.02,25.94 v17.02,25.91 | MK1.5 19.95,26.67 v21.59,26.67
  Top 0.254: v29.59,42.29 31.1,42.29 U3.9
  pour Bottom: -1.27,50.8 57.15,50.8 57.15,0 -1.27,0
(copper drawn outside any net)
  shapes: Top area x2

### Text on the board
Top: GoBabyGo board V_01 / 08/12/2019 By Hester Lab